# Altium project Development Board.PrjPcb
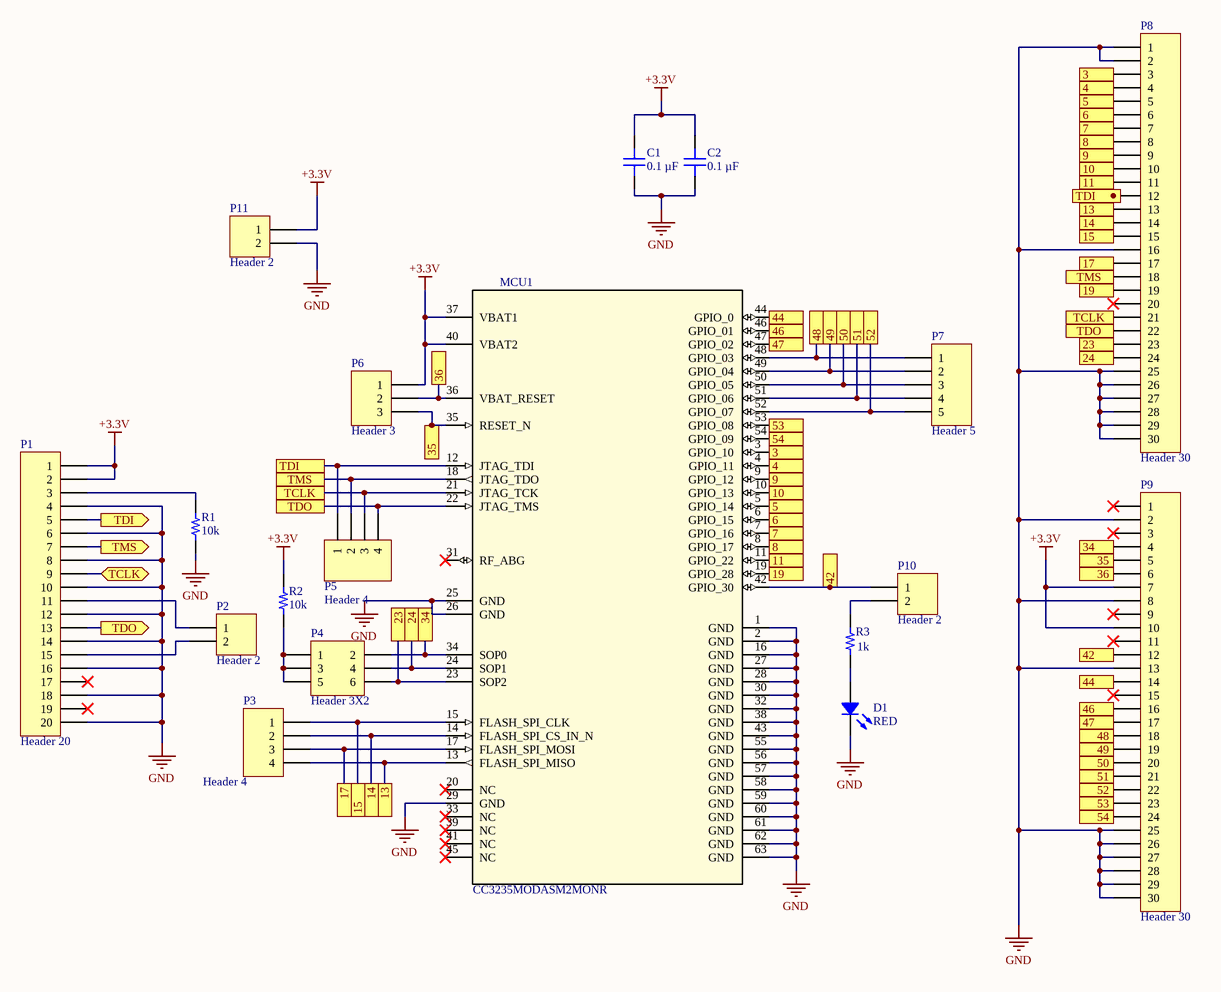
[diagram p0: Development Board.SchDoc]
1 sheet, 18 parts. Net scope: flat (ports and power ports of the same name join across sheets).

## Sheet Development Board.SchDoc
size B

### Parts
C1  0.1 µF  [CAP 1206_3216 - 0.8MM]
C2  0.1 µF  [CAP 1206_3216 - 0.8MM]
D1  RED  [CREE J 2835]
MCU1  CC3235MODASM2MONR  [CC3235MODASF12MONR]
P1  Header 20  [HDR2X10]
P2  Header 2  [HDR1X2]
P3  Header 4  [HDR1X4]
P4  Header 3X2  [HDR2X3]
P5  Header 4  [HDR1X4]
P6  Header 3  [HDR1X3]
P7  Header 5  [HDR1X5]
P8  Header 30  [HDR1X30]
P9  Header 30  [HDR1X30]
P10  Header 2  [HDR1X2]
P11  Header 2  [HDR1X2]
R1  10k  [RES 1206_3216]
R2  10k  [RES 1206_3216]
R3  1k  [RES 0805_2012]

### Ports
3, 4, 5, 6, 7, 8, 9, 10, 11, 13, 14, 15, 17, 19, 23, 24, 34, 35, 36, 42, 44, 46, 47, 48, 49, 50, 51, 52, 53, 54, TCLK, TCLK (bidir), TDI, TDI (out), TDO, TDO (out), TMS, TMS (out)

### Nets
+3.3V: C1.2 C2.2 MCU1.37(VBAT1) MCU1.40(VBAT2) P1.1 P1.2 P6.1 P9.7 P9.10 P11.1 R2.2
GND: C1.1 C2.1 D1.2 MCU1.1(GND) MCU1.2(GND) MCU1.16(GND) MCU1.25(GND) MCU1.26(GND) MCU1.27(GND) MCU1.28(GND) MCU1.29(GND) MCU1.30(GND) MCU1.32(GND) MCU1.38(GND) MCU1.43(GND) MCU1.55(GND) MCU1.56(GND) MCU1.57(GND) MCU1.58(GND) MCU1.59(GND) MCU1.60(GND) MCU1.61(GND) MCU1.62(GND) MCU1.63(GND) P1.4 P1.6 P1.8 P1.10 P1.12 P1.14 P1.16 P1.18 P1.20 P8.1 P8.2 P8.16 P8.25 P8.26 P8.27 P8.28 P8.29 P8.30 P9.2 P9.8 P9.13 P9.25 P9.26 P9.27 P9.28 P9.29 P9.30 P11.2 R1.1
NetD1_1: D1.1 R3.1
NetMCU1_3: MCU1.3(GPIO_10) P8.3 ; port 3
NetMCU1_4: MCU1.4(GPIO_11) P8.4 ; port 4
NetMCU1_5: MCU1.5(GPIO_14) P8.5 ; port 5
NetMCU1_6: MCU1.6(GPIO_15) P8.6 ; port 6
NetMCU1_7: MCU1.7(GPIO_16) P8.7 ; port 7
NetMCU1_8: MCU1.8(GPIO_17) P8.8 ; port 8
NetMCU1_9: MCU1.9(GPIO_12) P8.9 ; port 9
NetMCU1_10: MCU1.10(GPIO_13) P8.10 ; port 10
NetMCU1_11: MCU1.11(GPIO_22) P8.11 ; port 11
NetMCU1_12: MCU1.12(JTAG_TDI) P1.5 P5.1 ; port TDI
NetMCU1_13: MCU1.13(FLASH_SPI_MISO) P3.4 P8.13 ; port 13
NetMCU1_14: MCU1.14(FLASH_SPI_CS_IN_N) P3.2 P8.14 ; port 14
NetMCU1_15: MCU1.15(FLASH_SPI_CLK) P3.1 P8.15 ; port 15
NetMCU1_17: MCU1.17(FLASH_SPI_MOSI) P3.3 P8.17 ; port 17
NetMCU1_18: MCU1.18(JTAG_TDO) P1.7 P5.2 P8.18 ; port TMS
NetMCU1_19: MCU1.19(GPIO_28) P8.19 ; port 19
NetMCU1_21: MCU1.21(JTAG_TCK) P1.9 P5.3 P8.21 ; port TCLK
NetMCU1_22: MCU1.22(JTAG_TMS) P1.13 P5.4 P8.22 ; port TDO
NetMCU1_23: MCU1.23(SOP2) P4.6 P8.23 ; port 23
NetMCU1_24: MCU1.24(SOP1) P4.4 P8.24 ; port 24
NetMCU1_34: MCU1.34(SOP0) P4.2 P9.4 ; port 34
NetMCU1_35: MCU1.35(RESET_N) P6.3 P9.5 ; port 35
NetMCU1_36: MCU1.36(VBAT_RESET) P6.2 P9.6 ; port 36
NetMCU1_42: MCU1.42(GPIO_30) P9.12 P10.1 ; port 42
NetMCU1_44: MCU1.44(GPIO_0) P9.14 ; port 44
NetMCU1_46: MCU1.46(GPIO_01) P9.16 ; port 46
NetMCU1_47: MCU1.47(GPIO_02) P9.17 ; port 47
NetMCU1_48: MCU1.48(GPIO_03) P7.1 P9.18 ; port 48
NetMCU1_49: MCU1.49(GPIO_04) P7.2 P9.19 ; port 49
NetMCU1_50: MCU1.50(GPIO_05) P7.3 P9.20 ; port 50
NetMCU1_51: MCU1.51(GPIO_06) P7.4 P9.21 ; port 51
NetMCU1_52: MCU1.52(GPIO_07) P7.5 P9.22 ; port 52
NetMCU1_53: MCU1.53(GPIO_08) P9.23 ; port 53
NetMCU1_54: MCU1.54(GPIO_09) P9.24 ; port 54
NetP1_3: P1.3 R1.2
NetP1_11: P1.11 P2.1
NetP1_15: P1.15 P2.2
NetP4_1: P4.1 P4.3 P4.5 R2.1
NetP10_2: P10.2 R3.2

Not connected (* = marked no-connect by the designer): MCU1 20(NC)* 31(RF_ABG)* 33(NC)* 39(NC)* 41(NC)* 45(NC)*; P1 17* 19*; P8 12 20*; P9 1* 3* 9* 11* 15*

### Library data of the parts
C1 C2 = CC1206MRX7R9BB104: CAP CER 0.1UF 50V X7R 1206; manufacturer: Yageo; Tolerance: ±20%; Part Number: CC1206MRX7R9BB104; Value: 0.1 µF; Applications: General Purpose; Capacitance: 0.1 µF; componentlink1description: Datasheet; componentlink1url: http://www.yageo.com/NewPortal/_en/search/productDocs.jsp?YageoPartNumber=CC1206MRX7R9BB104; componentlink2description: DigiKey Link; componentlink2url: https://www.digikey.com/en/products/detail/yageo/CC1206MRX7R9BB104/5884665; Device Package: 1206 (3216 Metric); lastupdated: 21.03.2022 18:20:56; Lifecycle Status: Active; Minimum Order: 1; Mounting Type: Surface Mount, MLCC; Operating Temperature: -55°C ~ 125°C; Package / Case: 1206 (3216 Metric); packaging: TapeAndReel; partid: 18893; Part Status: Active; price: 0.02; series: CC; Size / Dimension: 0.126" L x 0.063" W (3.20mm x 1.60mm); Supplier 1: DigiKey; Supplier Part Number 1: 311-4502-1-ND; Temperature Coefficient: X7R; Thickness (Max): 0.037" (0.95mm); Voltage - Rated: 50V
D1 = JE2835AWT-00-0000-000A0UF957E: CREE J SERIES JE2835 LIGHT EMITT; Manufacturer: Cree Inc.; CCT (K): 5700K; CRI (Color Rendering Index): 90; Current - Max: 240mA; Current - Test: 150mA; Flux @ 25°C, Current - Test: 64lm (Typ); Lumens/Watt @ Current - Test: 142 lm/W; Viewing Angle: 120°; Voltage - Forward (Vf) (Typ): 3V; Part Number: JE2835AWT-00-0000-000A0UF957E; ComponentLink1Description: Datasheet; ComponentLink1URL: https://www.cree.com/led-components/media/documents/data-sheet-JSeries-2835-3v.pdf; ComponentLink2Description: DigiKey Link; ComponentLink2URL: http://digikey.com/product-detail/en/cree-inc/JE2835AWT-00-0000-000A0UF957E/JE2835AWT-00-0000-000A0UF957ECT-ND/9974563; Device Package: 1113 (2835 Metric); LastUpdated: 21.03.2022 19:13:25; Lifecycle Status: Active; Minimum Order: 1; Mounting Type: Surface Mount; Package / Case: 1113 (2835 Metric); Packaging: TapeAndReel; PartId: 22; Part Status: 1113 (2835 Metric); Price: 0.02; Series: J; Supplier 1: DigiKey; Supplier Part Number 1: JE2835AWT-00-0000-000A0UF957ECT-ND; Supplier Device Package: SMD
MCU1 = CC3235MODASM2MONR: No Description Available; Mfr_Name: Texas Instruments; Type: DEV; RefDes: RefDes; Copyright: Copyright (C) 2021 Ultra Librarian. All rights reserved.; Manufacturer_Part_Number: CC3235MODASM2MONR
P1 = Header 20: Header, 20-Pin; LatestRevisionDate: 17-Jul-2002; LatestRevisionNote: Re-released for DXP Platform.; Publisher: Altium Limited
P2 P10 P11 = Header 2: Header, 2-Pin; LatestRevisionDate: 17-Jul-2002; LatestRevisionNote: Re-released for DXP Platform.; Publisher: Altium Limited
P3 P5 = Header 4: Header, 4-Pin; LatestRevisionDate: 17-Jul-2002; LatestRevisionNote: Re-released for DXP Platform.; Publisher: Altium Limited
P4 = Header 3X2: Header, 3-Pin, Dual row; LatestRevisionDate: 17-Jul-2002; LatestRevisionNote: Re-released for DXP Platform.; Publisher: Altium Limited
P6 = Header 3: Header, 3-Pin; LatestRevisionDate: 17-Jul-2002; LatestRevisionNote: Re-released for DXP Platform.; Publisher: Altium Limited
P7 = Header 5: Header, 5-Pin; LatestRevisionDate: 17-Jul-2002; LatestRevisionNote: Re-released for DXP Platform.; Publisher: Altium Limited
P8 P9 = Header 30: Header, 30-Pin; LatestRevisionDate: 17-Jul-2002; LatestRevisionNote: Re-released for DXP Platform.; Publisher: Altium Limited
R1 R2 = RNCS1206BKE1K00: RES 1K OHM 0.1% 1/8W 1206; Manufacturer: Stackpole Electronics Inc; Power (Watts): 0.125W, 1/8W; Resistance: 1 kOhms; Temperature Coefficient: ±25ppm/°C; Value: 1 kOhms; Part Number: RNCS1206BKE1K00; ComponentLink1Description: Datasheet; ComponentLink1URL: https://www.seielect.com/catalog/sei-rncs_rnch.pdf; ComponentLink2Description: DigiKey Link; ComponentLink2URL: https://www.digikey.com/en/products/detail/stackpole-electronics-inc/RNCS1206BKE1K00/1800333; Composition: Thin Film; Device Package: 1206 (3216 Metric); Features: Anti-Corrosive, Automotive AEC-Q200, Moisture Resistant; Height - Seated (Max): 0.026" (0.65mm); LastUpdated: 21.03.2022 18:41:15; Lifecycle Status: Active; Minimum Order: 1; Number of Terminations: 2; Operating Temperature: -55°C ~ 155°C; Package / Case: 1206 (3216 Metric); Packaging: TapeAndReel; PartId: 26856; Part Status: Active; Price: 0.09; Ratings: AEC-Q200; Series: RNCS; Size / Dimension: 0.120" L x 0.061" W (3.05mm x 1.55mm); Supplier 1: DigiKey; Supplier Part Number 1: RNCS1206BKE1K00CT-ND; Supplier Device Package: 1206; Tolerance: ±0.1%
R3 = CPF0805B1K0E: RES SMD 1K OHM 0.1% 1/10W 0805; Manufacturer: TE Connectivity Passive Product; Power (Watts): 0.1W, 1/10W; Resistance: 1 kOhms; Temperature Coefficient: ±25ppm/°C; Part Number: CPF0805B1K0E; Value: 1k; ComponentLink1Description: Datasheet; ComponentLink1URL: https://www.te.com/commerce/DocumentDelivery/DDEController?Action=srchrtrv&DocNm=1773200&DocType=DS&DocLang=English; ComponentLink2Description: DigiKey Link; ComponentLink2URL: https://www.digikey.com/en/products/detail/te-connectivity-passive-product/CPF0805B1K0E/2390399; Composition: Thin Film; Device Package: 0805 (2012 Metric); Height - Seated (Max): 0.026" (0.65mm); LastUpdated: 21.03.2022 18:47:23; Lifecycle Status: Active; Minimum Order: 1; Number of Terminations: 2; Operating Temperature: -55°C ~ 155°C; Package / Case: 0805 (2012 Metric); Packaging: TapeAndReel; PartId: 27725; Part Status: Active; Price: 0.10; Series: CPF, Neohm; Size / Dimension: 0.079" L x 0.049" W (2.00mm x 1.25mm); Supplier 1: DigiKey; Supplier Part Number 1: A106044CT-ND; Supplier Device Package: 0805; Tolerance: ±0.1%